# EAGLE design TCCM (EAGLE 9.4.2)
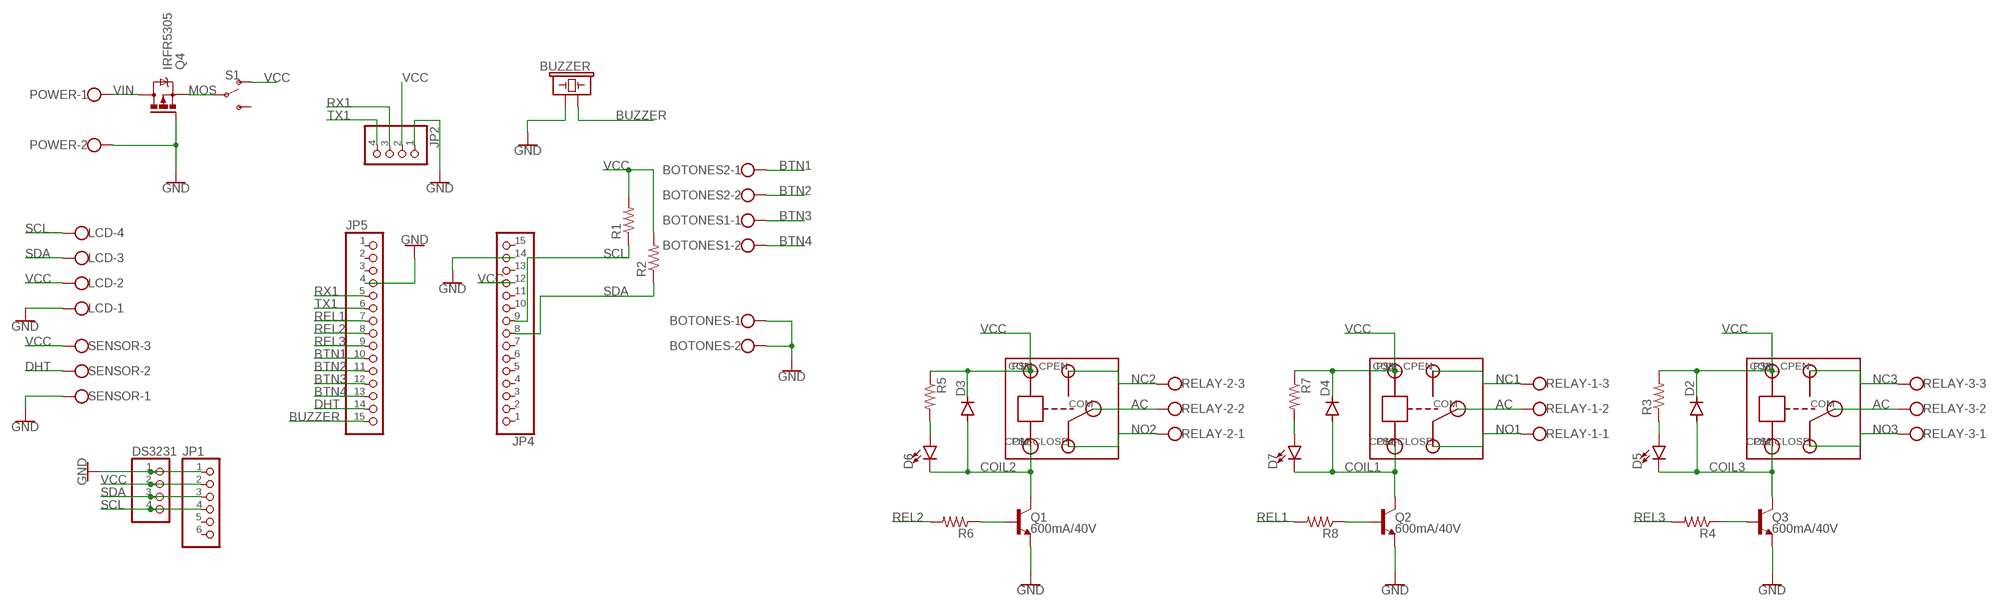
[diagram p0: schematic, sheet 1]

## Parts
BOTONES  W237-102  [W237-102]
BOTONES1  W237-102  [W237-102]
BOTONES2  W237-102  [W237-102]
BUZZER  BUZZER-PTH  [BUZZER-12MM]
D2  1N4148DO35-7  [DO35-7]
D3  1N4148DO35-7  [DO35-7]
D4  1N4148DO35-7  [DO35-7]
D5  LED3MM  [LED_3MM]
D6  LED3MM  [LED_3MM]
D7  LED3MM  [LED_3MM]
DS3231  PINHD-1X4  [1X04]
JP1  PINHD-1X6  [1X06]
JP2  PINHD-1X4  [1X04]
JP4  PINHD-1X15  [1X15]
JP5  PINHD-1X15  [1X15]
LCD  W237-4  [W237-4]
POWER  W237-102  [W237-102]
Q1  600mA/40V  TRANS_NPN-P2N2222A  [TO-92]
Q2  600mA/40V  TRANS_NPN-P2N2222A  [TO-92]
Q3  600mA/40V  TRANS_NPN-P2N2222A  [TO-92]
Q4  IRFR5305  [D-PAK_TO252AA]
R1  R-US_0207/7  [0207/7]
R2  R-US_0207/7  [0207/7]
R3  R-US_0207/7  [0207/7]
R4  R-US_0207/7  [0207/7]
R5  R-US_0207/7  [0207/7]
R6  R-US_0207/7  [0207/7]
R7  R-US_0207/7  [0207/7]
R8  R-US_0207/7  [0207/7]
RELAY-1  W237-103  [W237-103]
RELAY-2  W237-103  [W237-103]
RELAY-3  W237-103  [W237-103]
S1  SWITCH-SPDT-PTH-11.6X4.0MM  [SWITCH_SPDT_PTH_11.6X4.0MM]
SENSOR  W237-103  [W237-103]
U$1  RELAY  [RELAY]
U$2  RELAY  [RELAY]
U$3  RELAY  [RELAY]

## Nets
AC: RELAY-1.2 RELAY-2.2 RELAY-3.2 U$1.COM U$2.COM U$3.COM
BTN1: BOTONES2.1 JP5.10
BTN2: BOTONES2.2 JP5.11
BTN3: BOTONES1.1 JP5.12
BTN4: BOTONES1.2 JP5.13
BUZZER: BUZZER.+ JP5.15
COIL1: D4.A D7.K(C) Q2.1(C) U$2.P$2(GND)
COIL2: D3.A D6.K(C) Q1.1(C) U$1.P$2(GND)
COIL3: D2.A D5.K(C) Q3.1(C) U$3.P$2(GND)
DHT: JP5.14 SENSOR.2
GND: BOTONES.1 BOTONES.2 BUZZER.- DS3231.1 JP1.1 JP2.1 JP4.14 JP5.4 LCD.1 POWER.2 Q1.3(E) Q2.3(E) Q3.3(E) Q4.1(G) SENSOR.1
LED1: D7.A R7.2
LED2: D6.A R5.2
LED3: D5.A R3.1
MOS: Q4.3(S) S1.2(P)
N$4: Q3.2(B) R4.1
N$7: Q2.2(B) R8.1
N$14: Q1.2(B) R6.1
NC1: RELAY-1.3 U$2.COM_CPEN(COM-OPEN)
NC2: RELAY-2.3 U$1.COM_CPEN(COM-OPEN)
NC3: RELAY-3.3 U$3.COM_CPEN(COM-OPEN)
NO1: RELAY-1.1 U$2.COM-CLOSE
NO2: RELAY-2.1 U$1.COM-CLOSE
NO3: RELAY-3.1 U$3.COM-CLOSE
REL1: JP5.7 R8.2
REL2: JP5.8 R6.2
REL3: JP5.9 R4.2
RX1: JP2.3 JP5.5
SCL: DS3231.4 JP1.4 JP4.9 LCD.4 R1.1
SDA: DS3231.3 JP1.3 JP4.8 LCD.3 R2.1
TX1: JP2.4 JP5.6
VCC: D2.C D3.C D4.C DS3231.2 JP1.2 JP2.2 JP4.12 LCD.2 R1.2 R2.2 R3.2 R5.1 R7.1 S1.1(O) SENSOR.3 U$1.P$1(IN) U$2.P$1(IN) U$3.P$1(IN)
VIN: POWER.1 Q4.4(D)
Unconnected: JP1.5 JP1.6 JP4.1 JP4.2 JP4.3 JP4.4 JP4.5 JP4.6 JP4.7 JP4.10 JP4.11 JP4.13 JP4.15 JP5.1 JP5.2 JP5.3 S1.3(S)

## Library data of the parts
BOTONES BOTONES1 BOTONES2 POWER = con-wago-500:W237-102: WAGO SCREW CLAMP; MPN: 237-102; OC_FARNELL: unknown; OC_NEWARK: 70K9898
BUZZER = SparkFun-Electromechanical:BUZZER: Buzzer Small round buzzers that operate around the audible 2kHz range. You can use these as speakers to create simple music or user interfaces. Variant Overview: PTH - Mini Speaker - PC Mount 12mm 2.048kHz <https://www.sparkfun.com/products/7950> PTH_KIT - Mini Speaker - PC Mount 12mm 2.048kHz <https://www.sparkfun.com/products/7950> KIT simplifies soldering by adding stop mask to one side of the pads. PTH_NO_SILK - Mini Speaker - PC Mount 12mm 2.048kHz <https://www.sparkfun.com/products/7950> No silkscreen indicator of buzzer outline. PTH_KIT_NO_SILK - Mini Speaker - PC Mount 12mm 2.048kHz <https://www.sparkfun.com/products/7950> KIT package w/o silkscreen SMD - Buzzer Audio Magnetic (CCV-084B16) SMD buzzer used on, e.g. the LilyPad Buzzer <https://www.sparkfun.com/products/8463> and RFID USB Reader <https://www.sparkfun.com/products/9963>. SMD_KIT - Buzzer Audio Magnetic (CCV-084B16) SMD Buzzer with elongated pins to make soldering easier. Used on the SparkFun Simon Says - Surface Mount Soldering Kit <https://www.sparkfun.com/products/10935>.; PROD_ID: COMP-08253; SF_SKU: COM-07950
D2-D4 = diode:1N4148: DIODE high speed (Philips)
D5-D7 = SparkFun-LED:LED: LED (Generic) Standard schematic elements and footprints for 5mm, 3mm, 1206, and 0603 sized LEDs. Generic LEDs with no color specified.; PROD_ID: DIO-08794
DS3231 JP2 = pinhead:PINHD-1X4: PIN HEADER
JP1 = pinhead:PINHD-1X6: PIN HEADER
JP4 JP5 = pinhead:PINHD-1X15: PIN HEADER
LCD = con-wago-500:W237-4: WAGO SCREW CLAMP; OC_FARNELL: unknown; OC_NEWARK: unknown
Q1-Q3 = SparkFun-DiscreteSemi:TRANS_NPN: NPN transistor Current controlled devices typically used to amplify current or used as a switch. BC547 - COM-08928 <http://www.sparkfun.com/products/8928> (TO-92 45V 100mA) (1.Collector 2.Base 3.Emitter) 2N3904 - COM-00521 <http://www.sparkfun.com/products/521> (TO-92 40V 200mA) (1.Emitter 2.Base 3.Collector) P2N2222A - COM-12852 <http://www.sparkfun.com/products/12852> (TO-92 40V 600mA) (1.Collector 2.Base 3.Emitter); PROD_ID: TRANS-09536
Q4 = transistor-power:IRF?5305: HEXFET Power MOSFET Source: http://www.irf.com/product-info/datasheets/data/irfr5305pbf.pdf
R1-R8 = rcl:R-US_: RESISTOR, American symbol; SPICEPREFIX: R
RELAY-1-RELAY-3 SENSOR = con-wago-500:W237-103: WAGO SCREW CLAMP; MPN: 237-103; OC_FARNELL: unknown; OC_NEWARK: 18M7116
S1 = SparkFun-Switches:SWITCH-SPDT: Single Pole, Double Throw (SPDT) Switch Single-pole, double-throw (SPDT) switch. Variant Overview SMD-AYZ0202 Surface Mount DPDT Switch <https://www.sparkfun.com/products/597> (COM-00597) Used on e.g. LilyPad Arduino USB - ATmega32U4 Board <https://www.sparkfun.com/products/12049> PTH-11.6X4.0MM SPDT Mini Power Switch <https://www.sparkfun.com/products/102> (COM-00102) Used on e.g. SparkFun Simon Says - Through-Hole Soldering Kit <https://www.sparkfun.com/products/10547> (KIT-10547) PTH-11.6X4.0MM-KIT KIT version of SPDT Mini Power Switch - Simplifies soldering by removing tStop of switch pins - only one side can be soldered. PTH-11.6X4.0MM-LOCK LOCK version of SPDT Mini Power Switch - Offset pins hold switch in place for easier soldering. SMD-RIGHT-ANGLE Surface Mount Right Angle Switch <https://www.sparkfun.com/products/10860> (COM-10860) Used on e.g. SparkFun ESP8266 Thing <https://www.sparkfun.com/products/13231>; PROD_ID: SWCH-08261; SF_SKU: COM-00102
U$1-U$3 = RELAY:RELAY

## Board
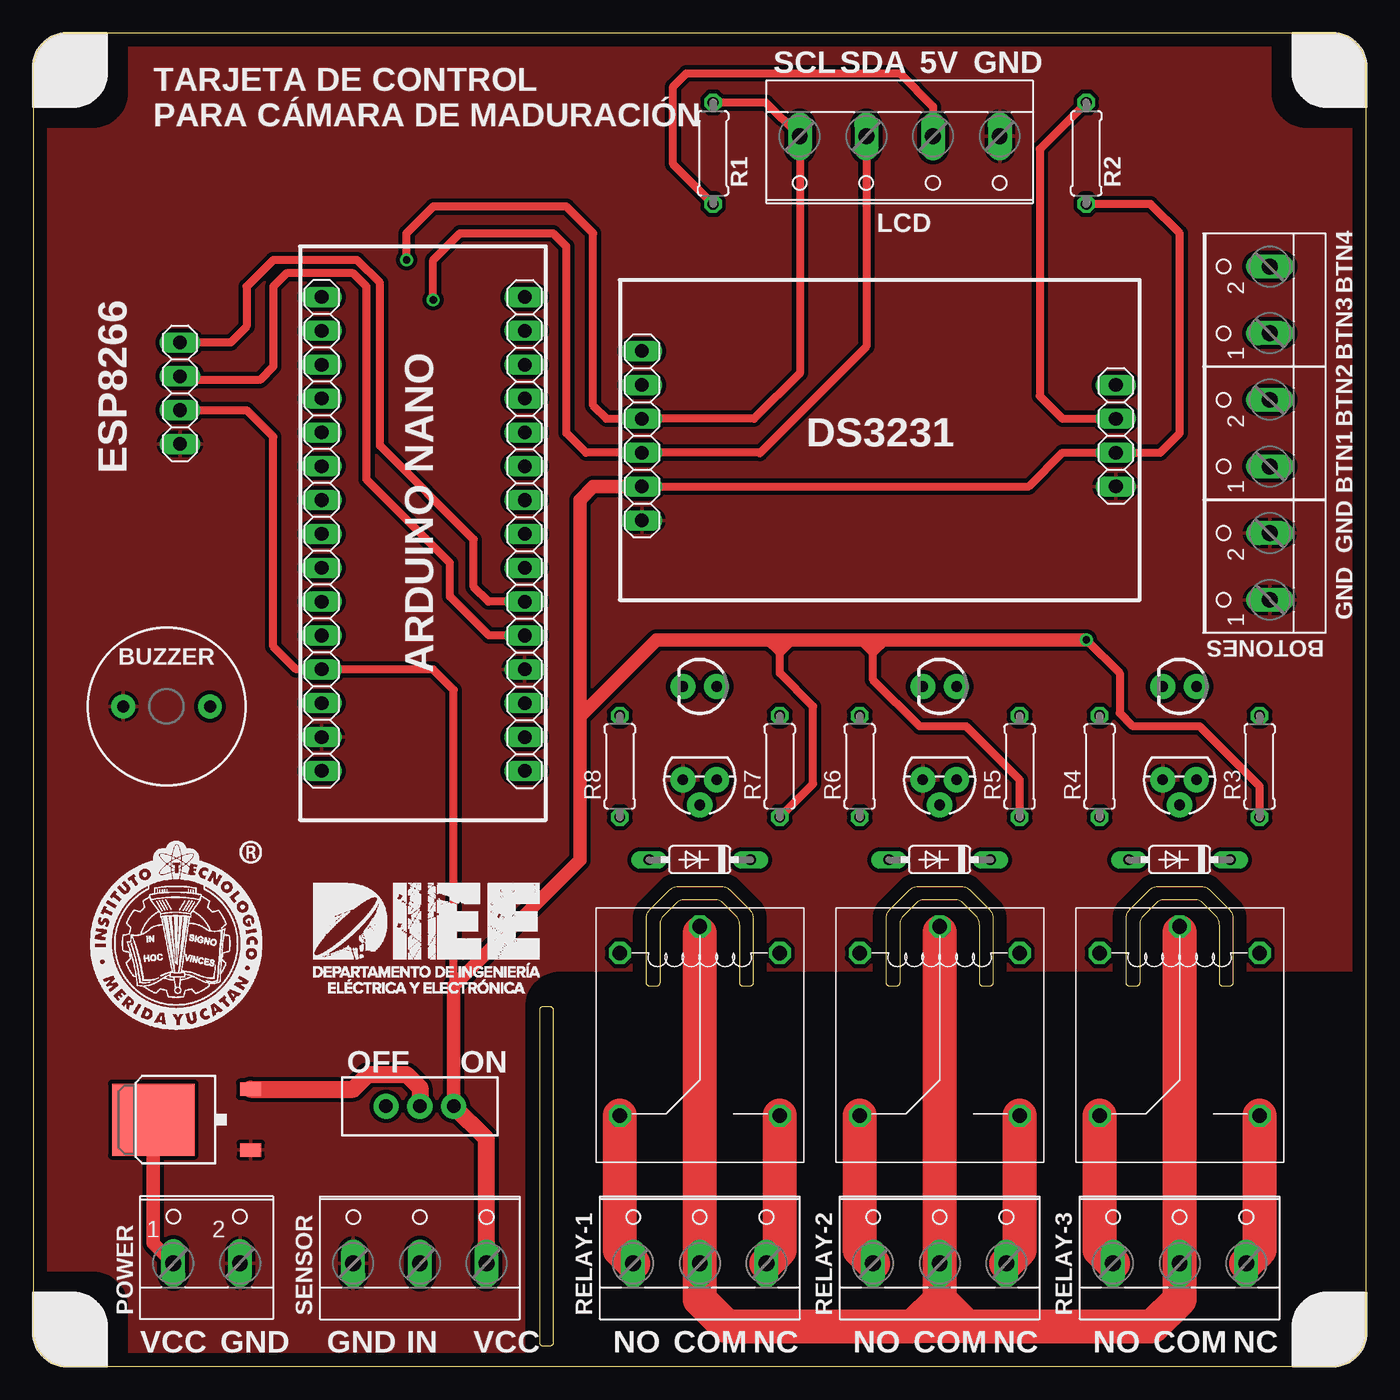
[diagram p1: board, top side]
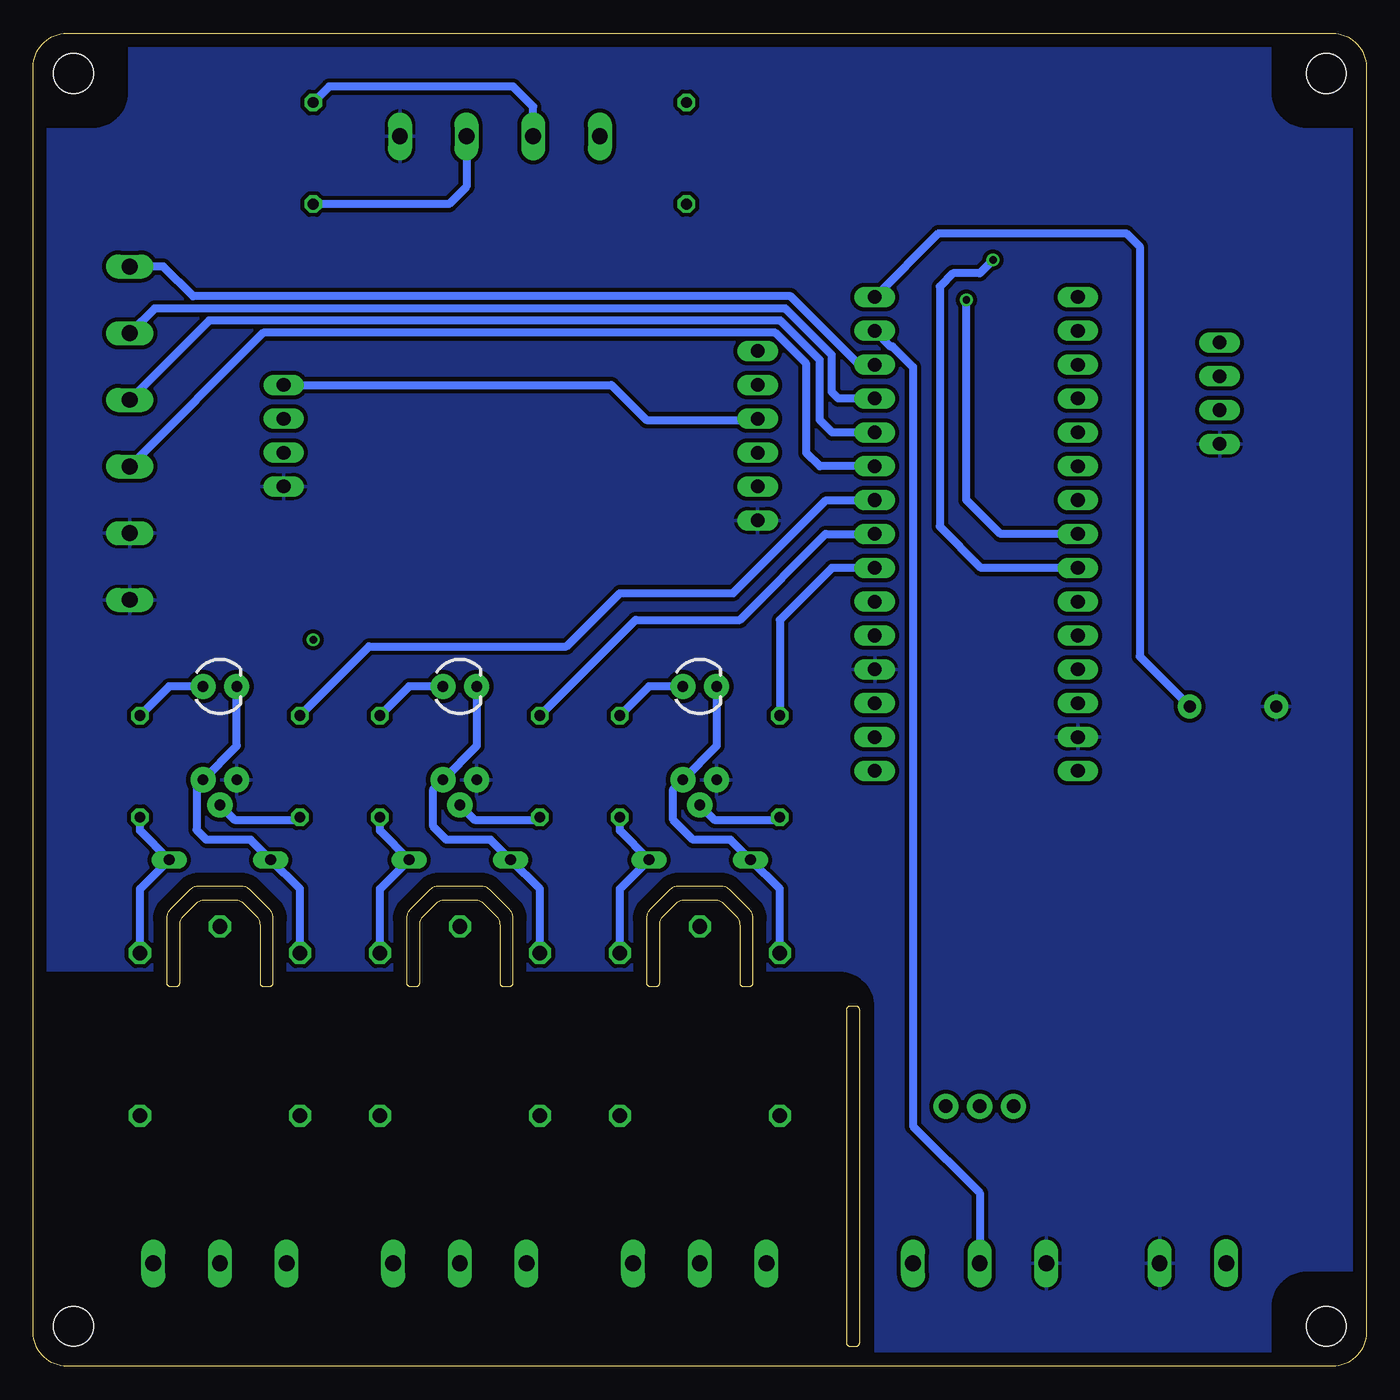
[diagram p2: board, bottom side, seen from below]

Size 100 x 100 mm. Coordinates in mm from the lower left corner, seen from the top.
Outline: 97.5,100 2.5,100 arc90 0,97.5 0,2.5 arc90 2.5,0 97.5,0 arc90 100,2.5 100,97.5 arc90 97.5,100
Outline: 46.75,28.5 46.25,28.5 arc-90 46,28.75 46,33.59 arc-45 46.29,34.29 47.71,35.71 arc-45 48.41,36 51.59,36 arc-45 52.29,35.71 53.71,34.29 arc-45 54,33.59 54,28.75 arc-90 53.75,28.5 53.25,28.5 arc-90 53,28.75 53,33.09 arc45 52.71,33.79 51.79,34.71 arc45 51.09,35 48.91,35 arc45 48.21,34.71 47.29,33.79 arc45 47,33.09 47,28.75 arc-90 46.75,28.5
Outline: 64,28.75 64,33.59 arc-45 64.29,34.29 65.71,35.71 arc-45 66.41,36 69.59,36 arc-45 70.29,35.71 71.71,34.29 arc-45 72,33.59 72,28.75 arc-90 71.75,28.5 71.25,28.5 arc-90 71,28.75 71,33.09 arc45 70.71,33.79 69.79,34.71 arc45 69.09,35 66.91,35 arc45 66.21,34.71 65.29,33.79 arc45 65,33.09 65,28.75 arc-90 64.75,28.5 64.25,28.5 arc-90 64,28.75
Outline: 82,28.75 82,33.59 arc-45 82.29,34.29 83.71,35.71 arc-45 84.41,36 87.59,36 arc-45 88.29,35.71 89.71,34.29 arc-45 90,33.59 90,28.75 arc-90 89.75,28.5 89.25,28.5 arc-90 89,28.75 89,33.09 arc45 88.71,33.79 87.79,34.71 arc45 87.09,35 84.91,35 arc45 84.21,34.71 83.29,33.79 arc45 83,33.09 83,28.75 arc-90 82.75,28.5 82.25,28.5 arc-90 82,28.75
Outline: 38,1.75 38,26.75 arc-90 38.25,27 38.75,27 arc-90 39,26.75 39,1.75 arc-90 38.75,1.5 38.25,1.5 arc-90 38,1.75
Copper layers (1*16): Top 0.035mm / dielectric 1.5mm / Bottom 0.035mm
Design rules "default *": minimum track width 6mil, minimum drill 0.55mm, track to track 12mil, track to pad 12mil, pad to pad 6mil, via to via 6mil, smd to smd 6mil, copper to edge 40mil, drill to drill 6mil, minimum pad ring 10mil, minimum via ring 8mil, stop-mask expansion 4mil, vias tented up to drill 25mil, thermal gap 10mil
Holes 3 mm at 97,3 3,3 3,97 97,97

### Footprints (pad centres in the part's own frame; a part is rotated, then mirrored left to right if it is on the bottom)
W237-102 = drill 1.194 long: 1 -2.5,-1.27; 2 2.5,-1.27
BUZZER-12MM = drill 0.9 pad 1.778: + 3.25,0; - -3.25,0
DO35-7 = drill 0.813 long: A 3.81,0; C -3.81,0
LED_3MM = drill 0.813 pad 1.88: A -1.27,0; K 1.27,0
1X04 = drill 1.016 long: 1 -3.81,0; 2 -1.27,0; 3 1.27,0; 4 3.81,0
1X06 = drill 1.016 long: 1 -6.35,0; 2 -3.81,0; 3 -1.27,0; 4 1.27,0; 5 3.81,0; 6 6.35,0
1X15 = drill 1.016 long: 1 -17.78,0; 2 -15.24,0; 3 -12.7,0; 4 -10.16,0; 5 -7.62,0; 6 -5.08,0; 7 -2.54,0; 8 0,0; 9 2.54,0; 10 5.08,0; 11 7.62,0; 12 10.16,0; 13 12.7,0; 14 15.24,0; 15 17.78,0
W237-4 = drill 1.194 long: 1 -7.5,-1.27; 2 -2.5,-1.27; 3 2.5,-1.27; 4 7.5,-1.27
TO-92 = drill 0.813 pad 1.88: 1 -1.27,0; 2 0,1.905; 3 1.27,0
D-PAK_TO252AA = smd 1 x 1.6: 1 -2.28,-4.8; 3 2.28,-4.8 | smd 5.4 x 6.2: 4 0,2.5
0207/7 = drill 0.813 octagon: 1 -3.81,0; 2 3.81,0
W237-103 = drill 1.194 long: 1 -5,-1.29; 2 0,-1.29; 3 5,-1.29
SWITCH_SPDT_PTH_11.6X4.0MM = drill 1.016 pad 1.88: 1 0,2.54; 2 0,0; 3 0,-2.54
RELAY = drill 1.1 octagon: COM -2,0; COM-CLOSE 12.2,-6; COM_CPEN 12.2,6; P$1 0,6; P$2 0,-6

### Placement (x,y rotation side)
BOTONES  91.5,60 90 top
BOTONES1  91.5,80 90 top
BOTONES2  91.5,70 90 top
BUZZER  10,49.5 0 top
D2  86,38 180 top
D3  68,38 180 top
D4  50,38 180 top
D5  86,51 180 top
D6  68,51 180 top
D7  50,51 180 top
DS3231  81.22,69.81 90 top
JP1  45.66,69.81 90 top
JP2  11,73 90 top
JP4  21.63,62.44 270 top
JP5  36.87,62.44 90 top
LCD  65,91 180 top
POWER  13,9 0 top
Q1  68,44 180 top
Q2  50,44 180 top
Q3  86,44 180 top
Q4  11.5,18.5 90 top
R1  51,91 270 top
R2  79,91 270 top
R3  92,45 270 top
R4  80,45 90 top
R5  74,45 90 top
R6  62,45 90 top
R7  56,45 90 top
R8  44,45 90 top
RELAY-1  50,9 0 top
RELAY-2  68,9 0 top
RELAY-3  86,9 0 top
S1  29,19.5 270 top
SENSOR  29,9 0 top
U$1  68,31 270 top
U$2  50,31 270 top
U$3  86,31 270 top

### Tracks (layer width: path | path; a pad name or v marks a point on that pad's centre or on a via)
AC
  Top 1.27: 50,32.5 U$2.COM | 86,32.56 U$3.COM | 68,32.56 U$1.COM | 67,4 68,5 69,4 67,4
  Top 2.54: 66,3 52,3 50,5 RELAY-1.2 50,32.5 | 68,5 RELAY-2.2 68,32.56 | 68,5 66,3 | 70,3 66,3 | 68,5 70,3 | 70,3 84,3 86,5 RELAY-3.2 86,32.56
BTN1
  Bottom 0.61: JP5.10 41,67.52 42,68.52 42,75.2 44.33,77.53 82.74,77.53 BOTONES2.1
BTN2
  Bottom 0.61: JP5.11 40.06,70.06 41,71 41,75.5 43.95,78.45 86.82,78.45 BOTONES2.2
BTN3
  Bottom 0.61: JP5.12 39.6,72.6 40.09,73.09 40.09,75.87 43.57,79.36 90.91,79.36 BOTONES1.1
BTN4
  Bottom 0.61: BOTONES1.2 90.25,82.5 88.03,80.28 43.19,80.28 38.06,75.14 JP5.13
BUZZER
  Bottom 0.61: JP5.15 32.09,85 18,85 17,84 17,53.25 BUZZER.+
COIL1
  Bottom 0.61: U$2.P$2 44,35.81 D4.A 47.69,39.5 50.5,39.5 52,41 52,43.27 Q2.1 48.73,46.54 D7.K
COIL2
  Bottom 0.61: D6.K 66.73,46.54 Q1.1 70,43.27 70,40.5 69,39.5 65.69,39.5 D3.A 62,35.81 U$1.P$2
COIL3
  Bottom 0.61: U$3.P$2 80,35.81 D2.A 83.69,39.5 87,39.5 87.75,40.25 87.75,43.52 Q3.1 84.73,46.54 D5.K
DHT
  Bottom 0.61: JP5.14 35.7,76.51 35.54,76.51 34,74.97 34,18 29,13 SENSOR.2
GND
  pour Top: 97.5,0 2.5,0 arc-90 0,2.5 0,97.5 arc-90 2.5,100 97.5,100 arc-90 100,97.5 100,2.5 arc-90
  pour Bottom: 97.5,0 2.5,0 arc-90 0,2.5 0,97.5 arc-90 2.5,100 97.5,100 arc-90 100,97.5 100,2.5 arc-90
ISOLATE
  cutout Top (no thermals): 0,7 0,2.54 arc90 2.54,0 7,0 7,4.5 arc90 4.5,7
  cutout Top (no thermals): 0,93 0,97.5 arc-90 2.5,100 7,100 7,95.5 arc-90 4.5,93
  cutout Top (no thermals): 93,100 97.5,100 arc-90 100,97.5 100,93 95.5,93 arc-90 93,95.5
  cutout Bottom (no thermals): 0,93 0,97.5 arc-90 2.5,100 7,100 7,95.5 arc-90 4.5,93
  cutout Bottom (no thermals): 93,100 97.5,100 arc-90 100,97.5 100,93 95.5,93 arc-90 93,95.5
  cutout Bottom (no thermals): 0,7 4.5,7 arc-90 7,4.5 7,0 2.5,0 arc-90 0,2.5
LED1
  Bottom 0.61: D7.A 53.81,51 R7.2
LED2
  Bottom 0.61: D6.A 71.81,51 R5.2
LED3
  Bottom 0.61: D5.A 89.81,51 R3.1
MOS
  Top 1.27: Q4.3 24,20.78 25.11,21.89 28,21.89 29,20.89 S1.2
N$4
  Bottom 0.61: Q3.2 84.91,41 80.19,41 R4.1
N$7
  Bottom 0.61: Q2.2 48.91,41 44.19,41 R8.1
N$9
  cutout Top: 37,0 37,27 arc-90 39.5,29.5 45,29.5 45.5,30 45.5,34.5 47.5,36.5 52.5,36.5 54.5,34.5 54.5,30 55,29.5 63,29.5 63.5,30 63.5,34.5 65.5,36.5 70.5,36.5 72.5,34.5 72.5,30 73,29.5 81,29.5 81.5,30 81.5,34.5 83.5,36.5 88.5,36.5 90.5,34.5 90.5,30 91,29.5 100,29.5 100,2.5 arc-90 97.5,0
  cutout Bottom: 37,0 37,27 arc-90 39.5,29.5 45,29.5 45.5,30 45.5,34.5 47.5,36.5 52.5,36.5 54.5,34.5 54.5,30 55,29.5 63,29.5 63.5,30 63.5,34.5 65.5,36.5 70.5,36.5 72.5,34.5 72.5,30 73,29.5 81,29.5 81.5,30 81.5,34.5 83.5,36.5 88.5,36.5 90.5,34.5 90.5,30 91,29.5 100,29.5 100,2.5 arc-90 97.5,0
N$14
  Bottom 0.61: Q1.2 66.91,41 62.19,41 R6.1
NC1
  Top 2.54: RELAY-1.3 56,8.71 U$2.COM_CPEN
NC2
  Top 2.54: RELAY-2.3 74,8.71 U$1.COM_CPEN
NC3
  Top 2.54: RELAY-3.3 92,8.71 U$3.COM_CPEN
NO1
  Top 2.54: RELAY-1.1 44,8.71 U$2.COM-CLOSE
NO2
  Top 2.54: RELAY-2.1 62,8.71 U$1.COM-CLOSE
NO3
  Top 2.54: RELAY-3.1 80,8.71 U$3.COM-CLOSE
REL1
  Bottom 0.61: R8.2 44,56 40.1,59.9 JP5.7
REL2
  Bottom 0.61: R6.2 54.81,56 47,56 40.56,62.44 JP5.8
REL3
  Bottom 0.61: R4.2 74.81,54 60,54 56,58 47.5,58 40.52,64.98 JP5.9
RX1
  Top 0.61: JP2.3 11.27,74 17,74 18,75 18,81 19,82 24,82 25,81 25,66.53 31.26,60.26 31.26,57.74 34.18,54.82 JP5.5
SCL  (via drill 0.55)
  Top 0.61: R1.1 54.96,94.81 LCD.4 57.5,74.5 54.08,71.08 JP1.4 43,71.08 42,72.08 42,85 40,87 30,87 28,85 v28,83
  Bottom 0.61: JP4.9 28.9,59.9 32,63 32,81 31,82 29,82 v28,83 | DS3231.4 56.62,73.62 54,71 45.74,71 JP1.4
SDA  (via drill 0.55)
  Top 0.61: LCD.3 62.5,76.5 54.5,68.5 54.46,68.54 JP1.3 41.46,68.54 40,70 40,84 39,85 32,85 30,83 v30,80 | DS3231.3 77.22,71.08 75.5,72.8 75.5,91.31 R2.1
  Bottom 0.61: LCD.3 62.5,94.5 64,96 77.81,96 R2.1 | JP4.8 27.44,62.44 30,65 v30,80
TX1
  Top 0.61: JP5.6 34.14,57.36 33.03,58.47 33.03,62.03 26,69.07 26,81.29 24.29,83 18,83 16,81 16,78 14.81,76.81 JP2.4
VCC  (via drill 0.55)
  Top 0.61: JP1.2 74.68,66 77.22,68.54 DS3231.2 84.54,68.54 86,70 86,85 83.81,87.19 R2.2 | R7.1 58.5,43.69 58.5,49.5 56,52 56,53.5 | R5.1 74,44 70,48 66.5,48 63,51.5 63,53.5 | R3.2 92,43.5 87.5,48 82.5,48 81.5,49 81.5,52 v79,54.5 | 63,53.5 63,54.5 | 56,53.5 56,54.5 | 63,53.5 64,54.5 | 63,53.5 62,54.5 61.5,54.5 | 56,53.5 57,54.5 | 56,53.5 55,54.5 54.5,54.5 | JP2.2 16,71.73 18,69.73 18,54 19.72,52.28 JP4.12 30,52.28 31.54,50.74 31.54,28.54 | R1.2 48,90.19 48,96 49,97 65,97 67.5,94.5 LCD.2
  Top 1.016: v79,54.5 64,54.5 63,54.5 61.5,54.5 57,54.5 56,54.5 54.5,54.5 46.75,54.5 41,48.75 | S1.1 31.54,28.54 41,38 41,48.75 | JP1.2 42,66 41,65 41,48.75
  Top 1.27: SENSOR.3 34,17.04 S1.1
  Bottom 0.61: R5.1 74,40.19 D3.C 74,35.81 U$1.P$1 | U$2.P$1 56,35.81 D4.C 56,40.19 R7.1 | U$3.P$1 92,35.81 D2.C 92,40.19 R3.2 | LCD.2 67.5,88.5 68.81,87.19 R2.2
VIN
  Top 1.016: POWER.1 9,9.23 Q4.4

### Text on the board
tNames: SCL | SDA | 5V | GND | TARJETA DE CONTROL / PARA CÁMARA DE MADURACIÓN | BTN4 | BTN3 | BTN2 | DS3231 | ESP8266 | BTN1 | GND | GND | ARDUINO NANO | OFF | ON | VCC | GND | GND | IN | VCC | NO | COM | NC | NO | COM | NC | NO | COM | NC